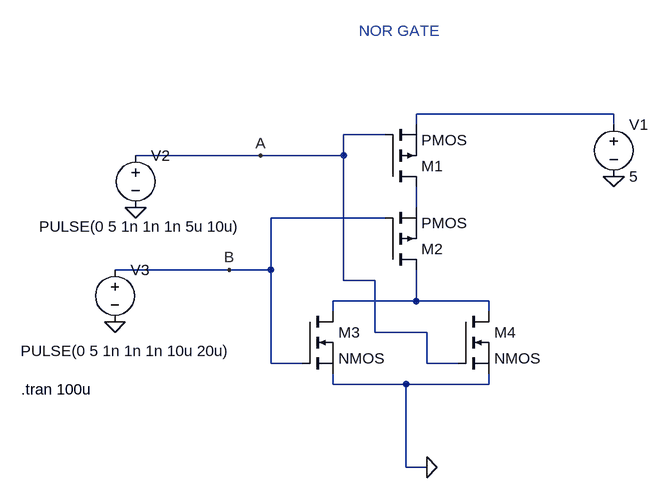
[diagram p0: schematic CMOS_NOR.asc]
CMOS_NOR.asc, the LTspice schematic file:
Version 4.1
SHEET 1 880 680
WIRE 512 16 208 16
WIRE 208 32 208 16
WIRE 512 32 512 16
WIRE 160 48 96 48
WIRE -32 80 -224 80
WIRE 96 80 96 48
WIRE 96 80 -32 80
WIRE 208 160 208 128
WIRE 160 176 -16 176
WIRE -80 256 -256 256
WIRE -16 256 -16 176
WIRE -16 256 -80 256
WIRE 96 272 96 80
WIRE 144 272 96 272
WIRE 208 304 208 256
WIRE 208 304 80 304
WIRE 320 304 208 304
WIRE 80 320 80 304
WIRE 320 320 320 304
WIRE 144 352 144 272
WIRE 224 352 144 352
WIRE -16 400 -16 256
WIRE 32 400 -16 400
WIRE 224 400 224 352
WIRE 272 400 224 400
WIRE 80 432 80 416
WIRE 192 432 80 432
WIRE 320 432 320 416
WIRE 320 432 192 432
WIRE 192 560 192 432
WIRE 224 560 192 560
FLAG 512 112 0
FLAG -224 160 0
FLAG -256 336 0
FLAG 224 560 0
FLAG -32 80 A
FLAG -80 256 B
SYMBOL pmos 160 128 M180
SYMATTR InstName M1
SYMBOL pmos 160 256 M180
SYMATTR InstName M2
SYMBOL nmos 32 320 R0
SYMATTR InstName M3
SYMBOL nmos 272 320 R0
SYMATTR InstName M4
SYMBOL voltage 512 16 R0
WINDOW 123 0 0 Left 0
WINDOW 39 0 0 Left 0
SYMATTR InstName V1
SYMATTR Value 5
SYMBOL voltage -224 64 R0
WINDOW 3 -149 125 Left 2
WINDOW 123 0 0 Left 0
WINDOW 39 0 0 Left 0
SYMATTR InstName V2
SYMATTR Value PULSE(0 5 1n 1n 1n 5u 10u)
SYMBOL voltage -256 240 R0
WINDOW 3 -145 141 Left 2
WINDOW 123 0 0 Left 0
WINDOW 39 0 0 Left 0
SYMATTR InstName V3
SYMATTR Value PULSE(0 5 1n 1n 1n 10u 20u)
TEXT -400 440 Left 2 !.tran 100u
TEXT 120 -112 Left 2 ;NOR GATE

The netlist it stands for:
* CMOS_NOR.asc
M1 N002 A N001 N001 PMOS
M2 N003 B N002 N002 PMOS
M3 N003 B 0 0 NMOS
M4 N003 A 0 0 NMOS
V1 N001 0 5
V2 A 0 PULSE(0 5 1n 1n 1n 5u 10u)
V3 B 0 PULSE(0 5 1n 1n 1n 10u 20u)
.model NMOS NMOS
.model PMOS PMOS
.lib standard.mos
.tran 100u
* NOR GATE
.backanno
.end